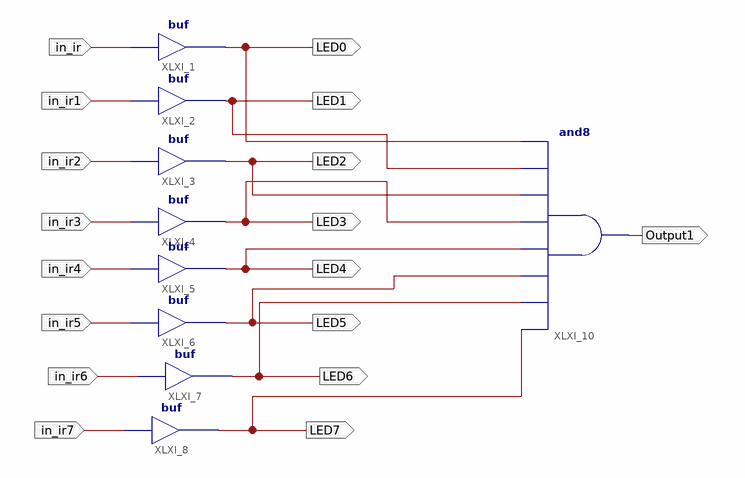
[diagram p0: schematic sheet 1]
// Xilinx ISE schematic led.sch (spartan6) as structural Verilog: 9 symbols, 17 ports
module led (
  input  in_ir,
  input  in_ir1,
  input  in_ir2,
  input  in_ir3,
  input  in_ir4,
  input  in_ir5,
  input  in_ir6,
  input  in_ir7,
  output LED0,
  output LED1,
  output LED2,
  output LED3,
  output LED4,
  output LED5,
  output LED6,
  output LED7,
  output Output1
);

  buf XLXI_1 (LED0, in_ir);
  buf XLXI_2 (LED1, in_ir1);
  buf XLXI_3 (LED2, in_ir2);
  buf XLXI_4 (LED3, in_ir3);
  buf XLXI_5 (LED4, in_ir4);
  buf XLXI_6 (LED5, in_ir5);
  buf XLXI_7 (LED6, in_ir6);
  buf XLXI_8 (LED7, in_ir7);
  and XLXI_10 (Output1, LED7, LED6, LED5, LED4, LED3, LED2, LED1, LED0);
endmodule
